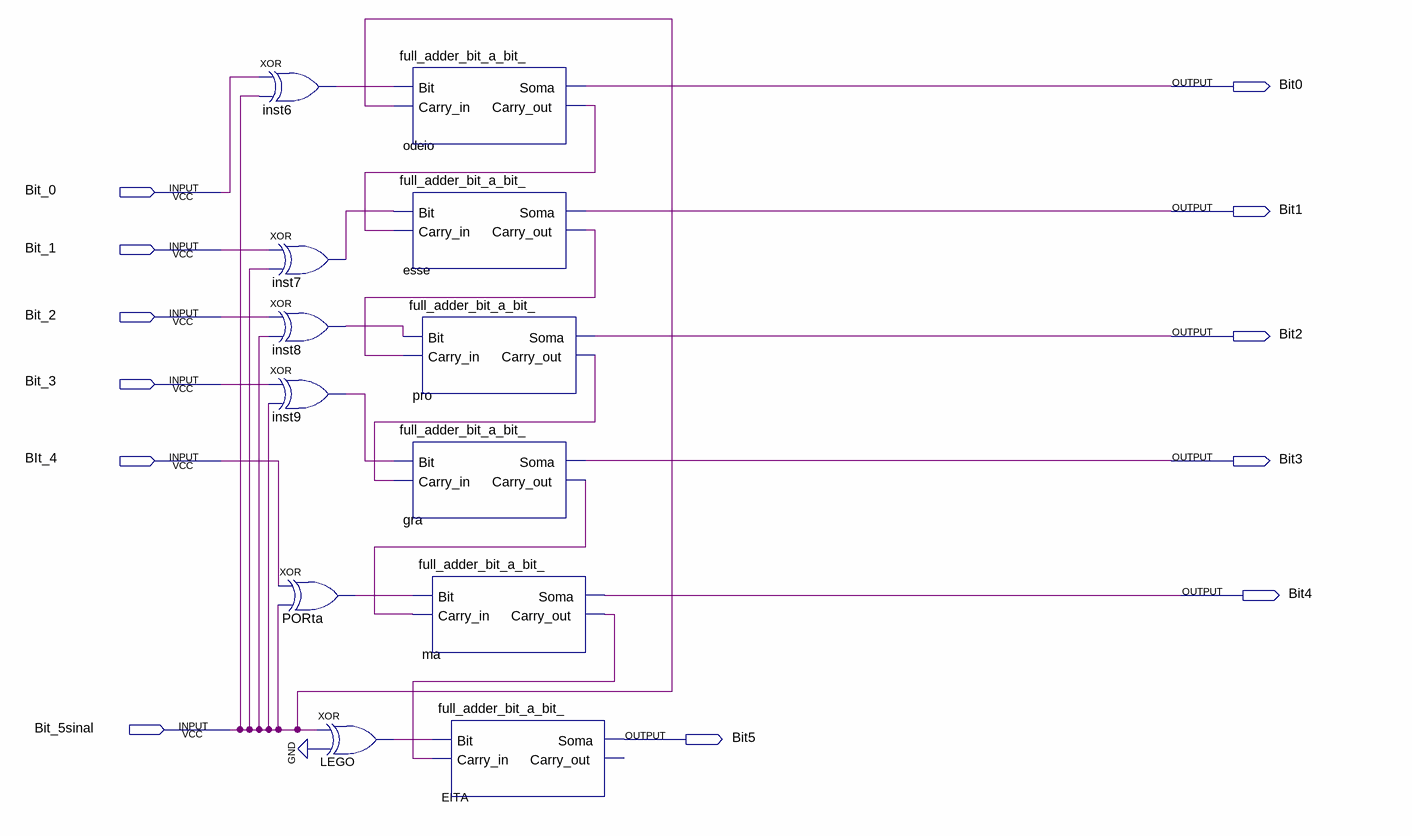
[diagram p0: schematic sheet]
// Quartus schematic complemento_final.bdf as structural Verilog: 12 symbols, 12 pins
module complemento_final (
  input  Bit_0,
  input  Bit_1,
  input  Bit_2,
  input  Bit_3,
  input  BIt_4,
  input  Bit_5sinal,
  output Bit0,
  output Bit1,
  output Bit2,
  output Bit3,
  output Bit4,
  output Bit5
);

  wire esse_carry_out, gra_carry_out, inst6_out, inst7_out, inst8_out, inst9_out, LEGO_out, ma_carry_out,
       odeio_carry_out, PORta_out, pro_carry_out;

  xor inst6 (inst6_out, Bit_0, Bit_5sinal);
  xor inst7 (inst7_out, Bit_1, Bit_5sinal);
  xor inst8 (inst8_out, Bit_2, Bit_5sinal);
  xor inst9 (inst9_out, Bit_3, Bit_5sinal);
  xor PORta (PORta_out, BIt_4, Bit_5sinal);
  xor LEGO (LEGO_out, Bit_5sinal, 1'b0);
  full_adder_bit_a_bit_ odeio (.Bit(inst6_out), .Carry_in(Bit_5sinal), .Soma(Bit0), .Carry_out(odeio_carry_out));
  full_adder_bit_a_bit_ esse (.Bit(inst7_out), .Carry_in(odeio_carry_out), .Soma(Bit1), .Carry_out(esse_carry_out));
  full_adder_bit_a_bit_ pro (.Bit(inst8_out), .Carry_in(esse_carry_out), .Soma(Bit2), .Carry_out(pro_carry_out));
  full_adder_bit_a_bit_ gra (.Bit(inst9_out), .Carry_in(pro_carry_out), .Soma(Bit3), .Carry_out(gra_carry_out));
  full_adder_bit_a_bit_ ma (.Bit(PORta_out), .Carry_in(gra_carry_out), .Soma(Bit4), .Carry_out(ma_carry_out));
  full_adder_bit_a_bit_ EITA (.Bit(LEGO_out), .Carry_in(ma_carry_out), .Soma(Bit5));  // open: Carry_out
endmodule
